# EAGLE design usb_spi (EAGLE 7.5.0)
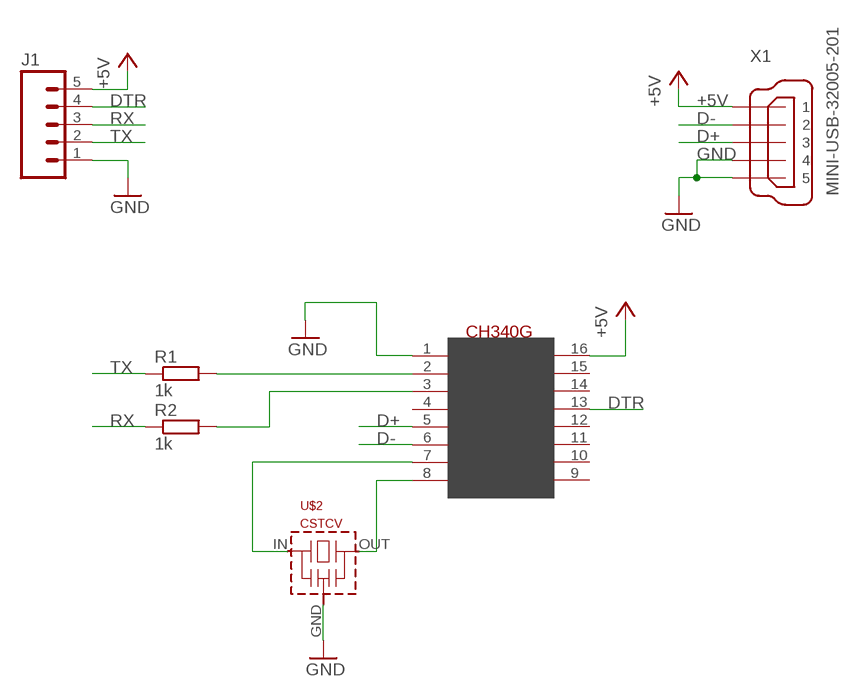
[diagram p0: schematic, sheet 1]

## Parts
J1  M05PTH  [1X05]
R1  1k  R-EU_R0402  [R0402]
R2  1k  R-EU_R0402  [R0402]
U$1  CH340G  [SOIC16]
U$2  CSTCV  [CSTCV]
X1  MINI-USB-32005-201  [32005-201]

## Nets
+5V: J1.5 U$1.16(VCC) X1.1
D+: U$1.5(D+) X1.3
D-: U$1.6(D-) X1.2
DTR: J1.4 U$1.13(DTR)
GND: J1.1 U$1.1(GND) U$2.GND X1.4 X1.5
N$1: R1.2 U$1.2(TX)
N$2: U$1.8(XO) U$2.OUT
N$4: R2.2 U$1.3(RX)
N$5: U$1.7(XI) U$2.IN
RX: J1.3 R2.1
TX: J1.2 R1.1
Unconnected: U$1.4(V3) U$1.9(CTS) U$1.10(DSR) U$1.11(RI) U$1.12(DCD) U$1.14(RTS) U$1.15(RS232)

## Library data of the parts
J1 = SparkFun-Connectors:M05: Header 5 Standard 5-pin 0.1" header. Use with straight break away headers (SKU : PRT-00116), right angle break away headers (PRT-00553), swiss pins (PRT-00743), machine pins (PRT-00117), and female headers (PRT-00115). Molex polarized connector foot print use with SKU : PRT-08230 with associated crimp pins and housings.
R1 R2 = resistor:R-EU_: RESISTOR, European symbol
U$1 = usb-serial:CH340G
U$2 = murata-cstcc-cstce-cstcr-cstcv-resonators:CSTCV: Murata CSTCV Resonator - 3,7 x 3,1 mm
X1 = con-cypressindustries:MINI-USB-: MINI USB-B Conector Source: www.cypressindustries.com; OC_FARNELL: unknown; OC_NEWARK: unknown

## Board
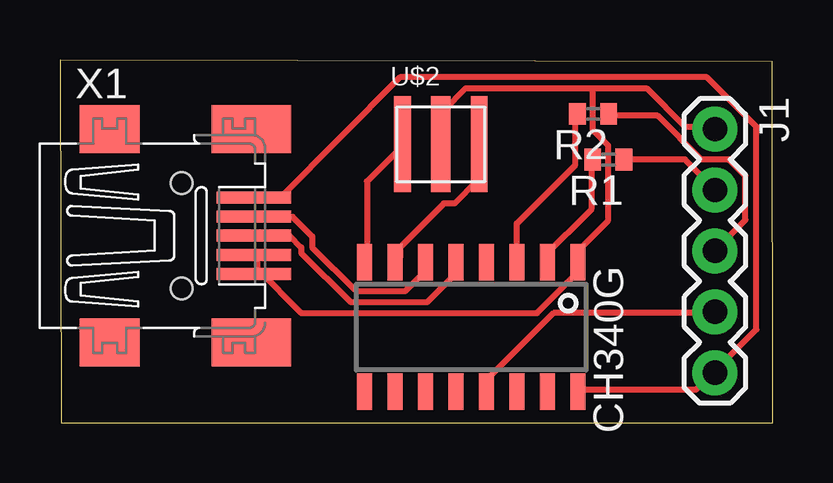
[diagram p1: board, top side]

Size 29.72 x 15.13 mm. Coordinates in mm from the lower left corner, seen from the top.
Outline: 0.05,0 29.72,0 29.69,15.05 0,15.13 0.05,0
Copper layers (1*16): Top 0.035mm / dielectric 1.5mm / Bottom 0.035mm
Design rules "default": minimum track width 10mil, minimum drill 24mil, track to track 8mil, track to pad 8mil, pad to pad 8mil, via to via 8mil, smd to smd 8mil, copper to edge 40mil, drill to drill 8mil, minimum pad ring 10mil, minimum via ring 8mil, stop-mask expansion 4mil, vias tented up to drill 0mil, thermal gap 10mil

### Footprints (pad centres in the part's own frame; a part is rotated, then mirrored left to right if it is on the bottom)
1X05 = drill 1.016 pad 1.88: 1 0,0; 2 2.54,0; 3 5.08,0; 4 7.62,0; 5 10.16,0
R0402 = smd 0.7 x 0.9: 1 -0.65,0; 2 0.65,0
SOIC16 = smd 0.635 x 1.524: 1 -4.445,-2.695; 2 -3.175,-2.695; 3 -1.905,-2.695; 4 -0.635,-2.695; 5 0.635,-2.695; 6 1.905,-2.695; 7 3.175,-2.695; 8 4.445,-2.695; 9 4.445,2.695; 10 3.175,2.695; 11 1.905,2.695; 12 0.635,2.695; 13 -0.635,2.695; 14 -1.905,2.695; 15 -3.175,2.695; 16 -4.445,2.695
CSTCV = smd 0.8 x 4: GND 0,0 | smd 0.7 x 4: IN 1.6,0; OUT -1.6,0
32005-201 = smd 3.1 x 0.5: 1 3,1.6; 2 3,0.8; 3 3,0; 4 3,-0.8; 5 3,-1.6 | smd 2.5 x 2: M1 -3,-4.45; M2 -3,4.45 | smd 3.3 x 2: M3 2.9,4.45; M4 2.9,-4.45 | hole 0.9: 0,2.2; 0,-2.2

### Placement (x,y rotation side)
J1  27.3,12.24 270 top
R1  22.86,10.97 180 top
R2  22.23,12.88 180 top
U$1  17.14,3.99 180 top
U$2  15.88,11.61 0 top
X1  5.08,7.8 0 top

### Tracks (layer width: path | path; a pad name or v marks a point on that pad's centre or on a via)
+5V
  Top 0.254: U$1.16 21.72,1.37 26.52,1.37 27.2,2.06 J1.5 27.43,2.29 29.03,3.89 29.03,12.34 26.98,14.4 14.17,14.4 9.2,9.4 8.05,9.4 X1.1
D+
  Top 0.254: X1.3 9.58,7.8 10.06,7.31 10.06,7.09 12.12,5.03 15.32,5.03 16.46,6.17 16.46,6.63 U$1.5
D-
  Top 0.254: U$1.6 15.09,6.63 15.09,6.17 14.4,5.49 12.34,5.49 10.52,7.31 10.52,7.77 9.7,8.58 8.1,8.58 X1.2
DTR
  Top 0.254: U$1.13 17.83,1.37 17.83,1.83 20.57,4.57 27.2,4.57 J1.4
GND
  Top 0.254: 8.23,6.4 10.06,4.57 19.89,4.57 21.49,6.17 21.49,6.63 U$1.1 21.72,6.86 21.72,7.29 22.86,8.43 22.86,11.56 22.23,12.19 22.23,13.89 22.17,13.94 | 8.23,6.4 8.23,6.86 X1.4 | 8.23,6.4 X1.5 | 22.17,13.94 16.92,13.94 16,13.03 16,11.66 U$2.GND | 22.17,13.94 24.46,13.94 26.06,12.34 27.2,12.34 J1.1
N$1
  Top 0.254: R1.2 22.17,10.97 22.17,8.92 20.12,6.86 U$1.2
N$2
  Top 0.254: U$1.8 12.8,6.86 12.8,10.06 14.17,11.43 U$2.OUT
N$4
  Top 0.254: U$1.3 19.05,8.31 21.49,10.74 21.49,12.8 R2.2
N$5
  Top 0.254: U$1.7 14.17,6.86 14.17,7.31 16,9.14 16.46,9.14 17.37,10.06 17.37,11.43 U$2.IN
RX
  Top 0.254: R2.1 23.09,12.8 24.92,12.8 26.75,10.97 27.89,10.97 28.57,10.29 28.57,8.46 27.43,7.31 J1.3
TX
  Top 0.254: R1.1 26.06,10.97 27.2,9.83 J1.2